# Altium schematic sheet IMU.SchDoc
size A
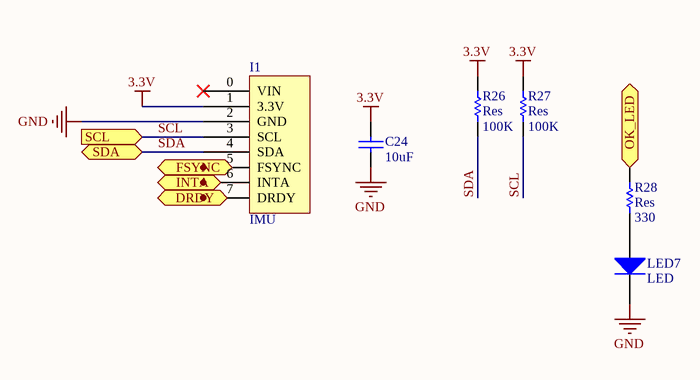
[diagram p0: IMU.SchDoc]

## Parts
C24  value 10uF  [2012[0805]]  (hidden comment: Cap_UP)
I1  IMU  [IMU]
LED7  LED  [2012[0805]]
R26  Res  value 100K  [2012[0805]]
R27  Res  value 100K  [2012[0805]]
R28  Res  value 330  [2012[0805]]

## Ports
DRDY, FSYNC, INTA, OK_LED (in), SCL (in), SDA (bidir)

## Nets
3.3V: C24.2 I1.1(3.3V) R26.2 R27.2
GND: C24.1 I1.2(GND) LED7.2(K)
OK_LED: R28.1 ; port OK_LED
SCL: I1.3(SCL) R27.1 ; port SCL
SDA: I1.4(SDA) R26.1 ; port SDA
NetLED7_1: LED7.1(A) R28.2

Not connected (* = marked no-connect by the designer): I1 0(VIN)* 5(FSYNC) 6(INTA) 7(DRDY)

## Library data of the parts
C24 = Cap_UP: Capacitor; Published: 8-Jun-2000; LatestRevisionDate: 17-Jul-2002; LatestRevisionNote: Re-released for DXP Platform.; PackageReference: RAD-0.3; Publisher: Altium Limited
LED7 = Diode: 1 Amp General Purpose Rectifier; Revision 1: 11-Jul-2000: SIM Model Added.; Revision 2: 17-Jul-2002: Re-released for DXP Platform.; Package Information: Latest Revision: Aug-1999; Code - JEDEC: DO-204-AL; Published: 8-Jun-2000; Datasheet: Latest Revision: 1998; Package Reference: DO-41; Publisher: Altium Limited
R26-R28 = Res: Semiconductor Resistor; Published: 8-Jun-2000; LatestRevisionDate: 17-Jul-2002; LatestRevisionNote: Re-released for DXP Platform.; PackageReference: AXIAL-0.5; Publisher: Altium Limited